# EAGLE design hdmi_fpc_rev2 (EAGLE 7.2.0)
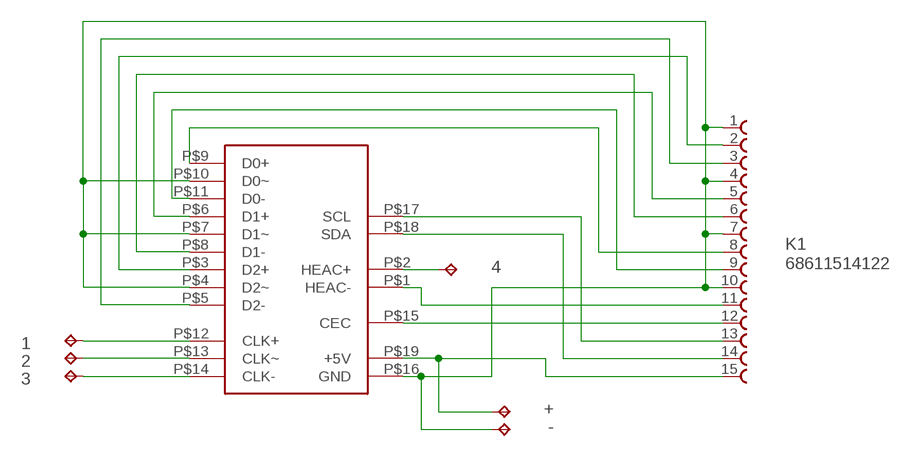
[diagram p0: schematic, sheet 1]

## Parts
1  TPPAD1-13  [P1-13]
2  TPPAD1-13  [P1-13]
3  TPPAD1-13  [P1-13]
4  TPPAD1-13  [P1-13]
+  TPPAD1-13  [P1-13]
-  TPPAD1-13  [P1-13]
K1  68611514122  [68611514122]
U$1  HDMI_MICRO  [MICRO_HDMI]

## Nets
GND: -.TP K1.1 K1.4 K1.7 K1.10 U$1.P$4(D2~) U$1.P$7(D1~) U$1.P$10(D0~) U$1.P$16(GND)
N$1: K1.6 U$1.P$8(D1-)
N$2: 1.TP U$1.P$12(CLK+)
N$3: K1.5 U$1.P$6(D1+)
N$4: K1.3 U$1.P$5(D2-)
N$5: K1.11 U$1.P$1(HEAC-)
N$6: K1.2 U$1.P$3(D2+)
N$7: K1.8 U$1.P$9(D0+)
N$8: 2.TP U$1.P$13(CLK~)
N$9: K1.9 U$1.P$11(D0-)
N$10: K1.13 U$1.P$17(SCL)
N$11: K1.14 U$1.P$18(SDA)
N$12: +.TP K1.15 U$1.P$19(+5V)
N$13: K1.12 U$1.P$15(CEC)
N$14: 3.TP U$1.P$14(CLK-)
N$15: 4.TP U$1.P$2(HEAC+)

## Library data of the parts
1-4 + - = testpad:TP: Test pad
K1 = EagleLibrary_Wuerth_Elektronik_eiCan_FPC_Connectors_&_Flat_Flexible_Cable_v6_20150113:68611514122: WR-FPC 1.00mm SMT ZIF Horizontal Top Contact, 15 Pins=>Code : Con_FPC_ZIF_1.00_68611514122 <http://katalog.we-online.de/media/images/eican/Con_FPC_ZIF_1.00_6861xx14122_pf2.jpg> Details see: http://katalog.we-online.de/en/em/686_1xx_141_22 Created 2014-07-09, Karrer Zheng 2014 (C) Würth Elektronik
U$1 = custom:HDMI

## Board
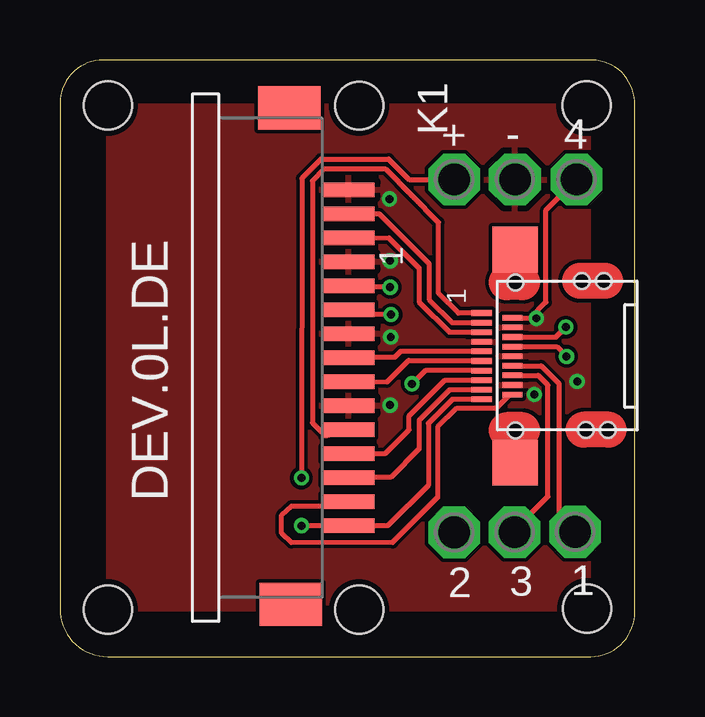
[diagram p1: board, top side]
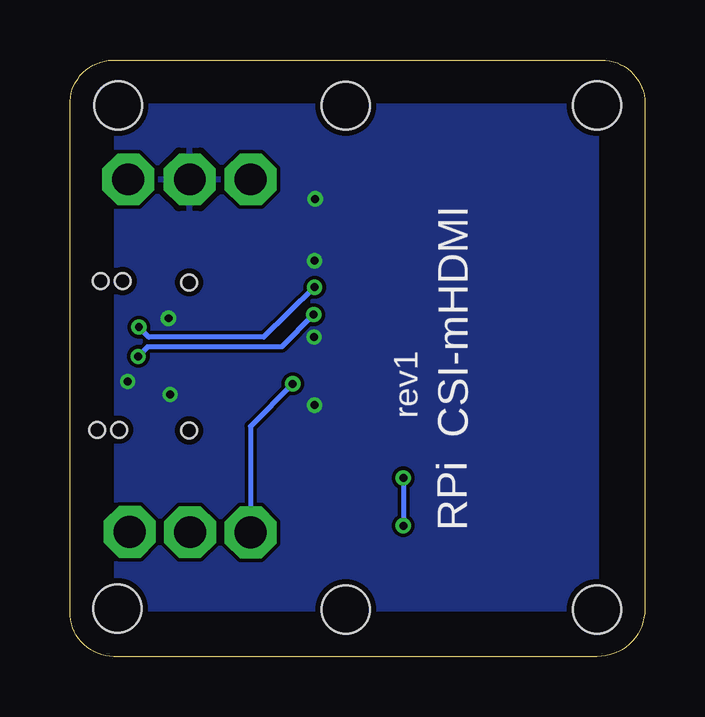
[diagram p2: board, bottom side, seen from below]

Size 23.97 x 24.88 mm. Coordinates in mm from the lower left corner, seen from the top.
Outline: 0,23.08 0,1.99 arc90 1.99,0 22.14,0 arc90 23.96,1.88 23.96,23 arc90 22.21,24.88 1.8,24.88 arc90 0,23.08
Copper layers (1*16): Top 0.035mm / dielectric 1.5mm / Bottom 0.035mm
Design rules "SeeedStudio_2layer_DRU_no_angle_20140221 *": minimum track width 6mil, minimum drill 12mil, track to track 6mil, track to pad 6mil, pad to pad 6mil, via to via 6mil, smd to smd 0mil, copper to edge 10mil, drill to drill 10mil, minimum pad ring 10mil, minimum via ring 6mil, stop-mask expansion 2mil, vias tented up to drill 100mil, thermal gap 10mil
Holes 2 mm at 21.96,22.99 1.99,22.99 21.98,2.01 1.99,1.97 12.47,1.97 12.47,22.97

### Footprints (pad centres in the part's own frame; a part is rotated, then mirrored left to right if it is on the bottom)
P1-13 = drill 1.321 pad 2.159 octagon: TP 0,0
68611514122 = smd 0.6 x 2.2: 1 -10.54,1.1; 2 -9.54,1.1; 3 -8.54,1.1; 4 -7.54,1.1; 5 -6.54,1.1; 6 -5.54,1.1; 7 -4.54,1.1; 8 -3.54,1.1; 9 -2.54,1.1; 10 -1.54,1.1; 11 -0.54,1.1; 12 0.46,1.1; 13 1.46,1.1; 14 2.46,1.1; 15 3.46,1.1 | smd 1.8 x 2.6: Z1 -13.95,-1.36; Z2 6.74,-1.29
MICRO_HDMI = smd 0.23 x 0.85: P$1 1.795,6.47; P$2 1.595,5.19; P$3 1.395,6.47; P$4 1.195,5.19; P$5 0.995,6.47; P$6 0.795,5.19; P$7 0.595,6.47; P$8 0.395,5.19; P$9 0.195,6.47; P$10 -0.005,5.19; P$11 -0.205,6.47; P$12 -0.405,5.19; P$13 -0.605,6.47; P$14 -0.805,5.19; P$15 -1.005,6.47; P$16 -1.205,5.19; P$17 -1.405,6.47; P$18 -1.605,5.19; P$19 -1.805,6.47 | smd 1.905 x 1.905: P$20 -4.445,5.08; P$21 4.445,5.08 | hole 0.65: -3.073,2.134; -3.073,1.219; 3.124,2.286; 3.124,1.372; -3.099,5.055; 3.073,5.055

### Placement (x,y rotation side)
1  21.48,5.21 0 top
2  16.43,5.18 0 top
3  18.96,5.19 0 top
4  21.54,19.9 0 top
+  16.43,19.9 0 top
-  18.97,19.9 0 top
K1  10.92,8.93 270 top
U$1  24.05,12.53 90 top

### Tracks (layer width: path | path; a pad name or v marks a point on that pad's centre or on a via)
GND  (via drill 0.33)
  other vias: 19.79,10.93 21.56,11.48 13.79,13.34 13.77,16.51 13.74,19.09 13.77,10.49 19.86,14.11
  pour Bottom: 1.99,22.96 22.05,22.97 22.05,2.01 1.99,1.99
  pour Top: 2.01,1.99 22.05,2.01 22.05,22.97 2.01,22.96
N$1  (via drill 0.33)
  Top 0.203: v13.8,14.26 12.07,14.26 K1.6 | U$1.P$8 20.71,12.93 v21.12,12.52
  Bottom 0.203: v13.8,14.26 15.14,12.92 20.55,12.92 20.73,12.92 v21.12,12.52
N$2
  Top 0.203: U$1.P$12 20.07,12.13 20.8,11.39 20.8,5.8 1.TP
N$3  (via drill 0.33)
  Top 0.152: U$1.P$6
  Top 0.203: U$1.P$6 20.68,13.33 v21.09,13.74 | v13.77,15.4 11.82,15.4 K1.5
  Bottom 0.203: v13.77,15.4 15.89,13.33 20.68,13.33 v21.09,13.74
N$4
  Top 0.203: K1.3 13.72,17.45 14.97,16.2 14.97,14.8 16.23,13.54 U$1.P$5
N$5
  Top 0.203: U$1.P$1 16.61,14.33 15.79,15.15 15.79,18.11 13.59,20.32 11,20.32 10.53,19.85 10.53,9.75 11.07,9.21 K1.11
N$6
  Top 0.203: K1.2 13.31,18.47 15.39,16.38 15.39,14.9 16.36,13.93 U$1.P$3
N$7
  Top 0.203: U$1.P$9 14.2,12.73 13.96,12.48 12.33,12.48 K1.8
N$8  (via drill 0.33)
  Top 0.203: U$1.P$13 15.23,11.93 v14.68,11.38
  Bottom 0.203: v14.68,11.38 16.45,9.6 2.TP
N$9
  Top 0.203: K1.9 13.64,11.46 14.54,12.36 17.56,12.36 U$1.P$11
N$10
  Top 0.203: U$1.P$17 16.25,11.13 14.97,9.86 14.97,8.66 13.79,7.48 12.42,7.48 K1.13
N$11
  Top 0.203: U$1.P$18 18.75,10.93 18.17,10.35 16.52,10.35 15.75,9.58 15.75,6.64 13.87,4.76 9.65,4.75 9.25,5.14 9.25,5.91 9.65,6.29 11.8,6.29 K1.14
N$12  (via drill 0.33)
  Top 0.203: U$1.P$19 16.36,10.73 15.35,9.73 15.35,7.15 13.66,5.46 12.31,5.46 K1.15 v10.08,5.47 v10.07,5.46 | v10.07,7.46 10.08,19.95 10.88,20.75 13.7,20.75 14.55,19.9 +.TP
  Bottom 0.203: v10.07,7.46 v10.07,5.46
N$13
  Top 0.203: K1.12 13.57,8.48 14.55,9.46 14.55,10.03 16.05,11.53 U$1.P$15
N$14
  Top 0.203: U$1.P$14 19.94,11.73 20.34,11.33 20.34,6.68 18.87,5.21 3.TP
N$15
  Top 0.203: U$1.P$2 19.62,14.13 20.27,14.78 20.27,18.63 4.TP

### Text on the board
tPlace: 1 | DEV.0L.DE
bPlace: CSI-mHDMI | rev1 | RPi